# EAGLE design TX16S ISRM Adapter (EAGLE 9.6.2)
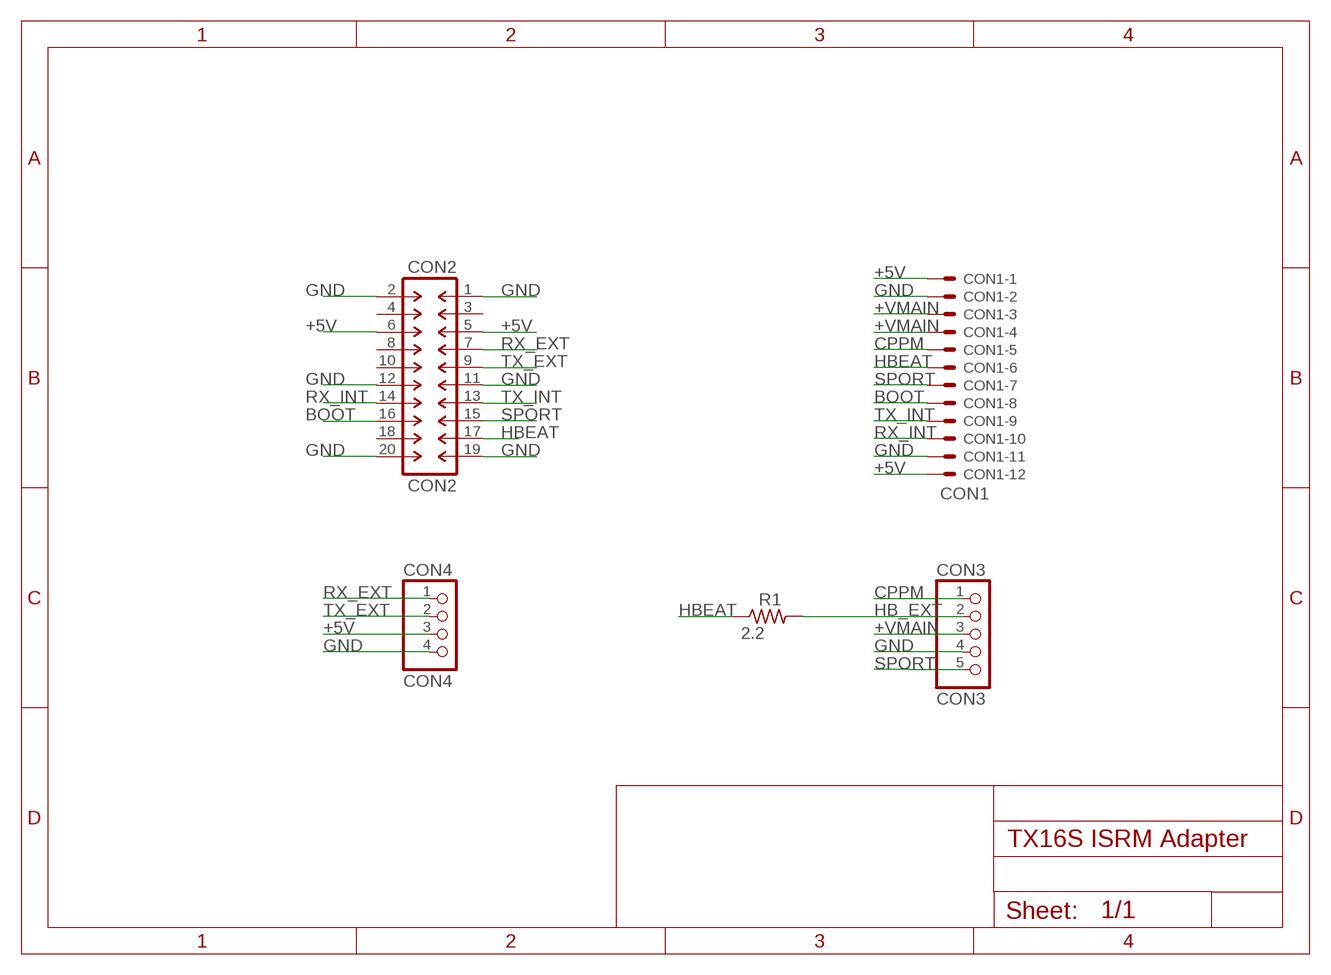
[diagram p0: schematic, sheet 1]

## Parts
CON1  CON1  53048-12  [53048-12]
CON2  CON2  M-2X10-DIL-2MM_M  [DIL-2MM-2X10_M]
CON3  CON3  PINHD-1X5  [1X05]
CON4  CON4  PINHD-1X4  [1X04]
R1  2.2  R-US_R0603  [R0603]

## Nets
+5V: CON1.1 CON1.12 CON2.5 CON2.6 CON4.3
+VMAIN: CON1.3 CON1.4 CON3.3
BOOT: CON1.8 CON2.16
CPPM: CON1.5 CON3.1
GND: CON1.2 CON1.11 CON2.1 CON2.2 CON2.11 CON2.12 CON2.19 CON2.20 CON3.4 CON4.4(GND)
HB_EXT: CON3.2 R1.2
HBEAT: CON1.6 CON2.17 R1.1
RX_EXT: CON2.7 CON4.1
RX_INT: CON1.10 CON2.14
SPORT: CON1.7 CON2.15 CON3.5
TX_EXT: CON2.9 CON4.2
TX_INT: CON1.9 CON2.13
Unconnected: CON2.3 CON2.4 CON2.8 CON2.10 CON2.18

## Library data of the parts
CON1 = con-molex-DK:53?-12: CONNECTOR wire to board 1.25 mm (.049 inch) pitch header
CON2 = con-headers-jp-DK:M-2X10-: MALE HEADER
CON3 = pinhead:PINHD-1X5: PIN HEADER
CON4 = pinhead:PINHD-1X4: PIN HEADER
R1 = rcl:R-US_: RESISTOR, American symbol; SPICEPREFIX: R

## Board
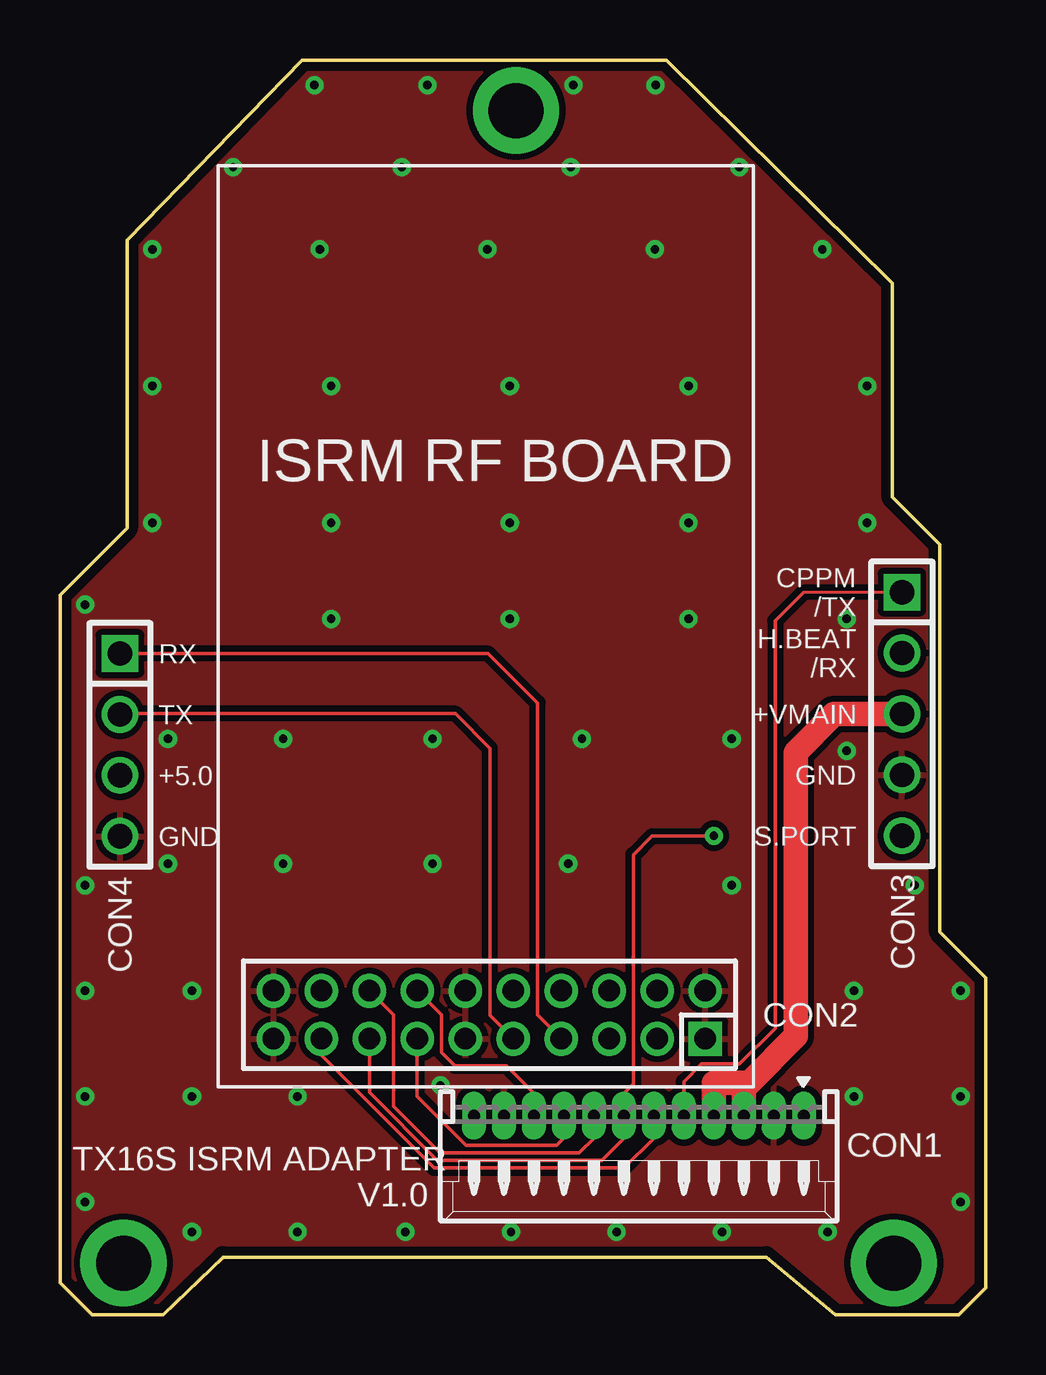
[diagram p1: board, top side]
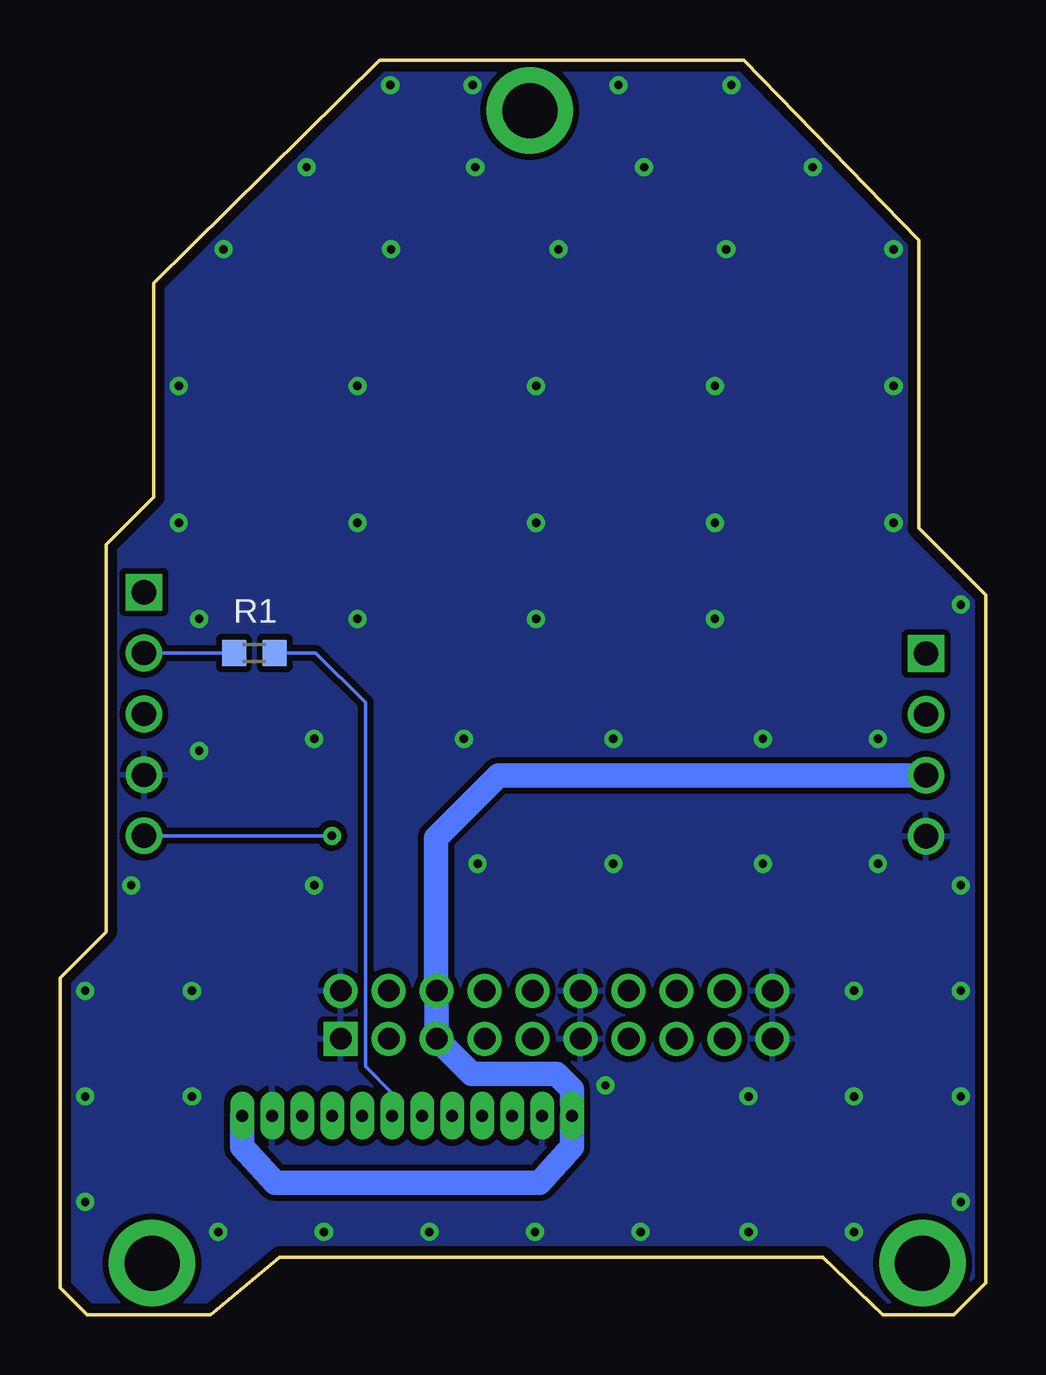
[diagram p2: board, bottom side, seen from below]

Size 38.6 x 52.3 mm. Coordinates in mm from the lower left corner, seen from the top.
Outline: 25.28,52.3 10.1,52.3 2.8,44.8 2.8,32.8 0,30 0,1.34 1.34,0 4.3,0 6.8,2.4 29.44,2.4 32.32,0 37.47,0 38.6,1.13 38.6,14.04 36.68,15.96 36.68,32.1 34.7,34.08 34.7,43 25.28,52.3
Copper layers (1*16): Top 0.035mm / dielectric 1.5mm / Bottom 0.035mm
Design rules "default *": minimum track width 6mil, minimum drill 0.35mm, track to track 6mil, track to pad 6mil, pad to pad 6mil, via to via 6mil, smd to smd 6mil, copper to edge 15mil, drill to drill 6mil, minimum pad ring 10mil, minimum via ring 8mil, stop-mask expansion 4mil, vias tented up to drill 20mil, thermal gap 10mil

### Footprints (pad centres in the part's own frame; a part is rotated, then mirrored left to right if it is on the bottom)
53048-12 = drill 0.5 pad 0.698 long: 1 -6.875,-1.25; 2 -5.625,-1.25; 3 -4.375,-1.25; 4 -3.125,-1.25; 5 -1.875,-1.25; 6 -0.625,-1.25; 7 0.625,-1.25; 8 1.875,-1.25; 9 3.125,-1.25; 10 4.375,-1.25; 11 5.625,-1.25; 12 6.875,-1.25
DIL-2MM-2X10_M = drill 0.9 square: 1 -9,1 | drill 0.9: 2 -9,-1; 3 -7,1; 4 -7,-1; 5 -5,1; 6 -5,-1; 7 -3,1; 8 -3,-1; 9 -1,1; 10 -1,-1; 11 1,1; 12 1,-1; 13 3,1; 14 3,-1; 15 5,1; 16 5,-1; 17 7,1; 18 7,-1; 19 9,1; 20 9,-1
1X05 = drill 1.016 square: 1 -5.08,0 | drill 1.016: 2 -2.54,0; 3 0,0; 4 2.54,0; 5 5.08,0
1X04 = drill 1.016 square: 1 -3.81,0 | drill 1.016: 2 -1.27,0; 3 1.27,0; 4 3.81,0
2,3-PAD = drill 2.3 pad 3.6: B2,3 0,0
R0603 = smd 1 x 1.1: 1 -0.85,0; 2 0.85,0

### Placement (x,y rotation side)
CON1  24.12,7.05 180 top
CON2  17.9,12.5 180 top
CON3  35.1,25.04 270 top
CON4  2.5,23.75 270 top
E$1  [2,3-PAD]  2.65,2.15 0 top
E$2  [2,3-PAD]  34.76,2.15 0 top
E$3  [2,3-PAD]  19.01,50.19 0 top
R1  30.5,27.58 180 bottom

### Tracks (layer width: path | path; a pad name or v marks a point on that pad's centre or on a via)
+5V
  Bottom 0.152: 22.92,13.52 CON2.6
  Bottom 0.813: 17.25,8.8 CON1.12
  Bottom 1.016: CON1.1 31,7 29.64,5.5 18.61,5.5 17.25,7 CON1.12 | 17.25,8.8 17.25,9.4 17.89,10.05 21.45,10.05 CON2.5 CON2.6 | CON4.3 20.31,22.48 22.92,19.87 22.92,13.52
+VMAIN
  Top 1.016: CON3.3 32.26,25.04 30.68,23.44 30.68,11.61 28.74,9.67 | 28.74,9.67 28.5,9.43 CON1.3 | 28.74,9.67 27.25,9.67 CON1.4
BOOT
  Top 0.152: CON1.8 22.25,7.36 21.64,6.75 15.85,6.75 13.91,8.69 13.91,12.49 CON2.16
CPPM
  Top 0.152: CON3.1 30.99,30.1 29.82,28.93 29.82,11.94 28.33,10.45 26.74,10.45 26,9.71 CON1.5
GND  (via drill 0.35)
  other vias: 15.86,9.56 5.5,3.45 9.9,3.45 14.4,3.45 18.8,3.45 23.2,3.45 27.6,3.45 32,3.45 1.05,17.9 1.05,13.5 1.05,9.1 1.05,4.7 35.63,17.9 37.55,13.5 37.55,9.1 37.55,4.7 1.05,29.6 3.85,33.01 3.85,38.71 3.85,44.41 10.61,51.25 15.32,51.25 21.4,51.25 24.83,51.25 7.22,47.83 28.32,47.83 31.78,44.41 33.65,33.01 33.65,38.71 14.25,47.83 21.29,47.83 10.83,44.41 17.82,44.41 24.8,44.41 11.3,38.71 18.75,38.71 26.2,38.71 11.3,33.01 18.75,33.01 26.2,33.01 11.3,29 18.75,29 26.2,29 32.8,29 32.8,23.5 4.5,24 9.3,24 15.53,24 21.76,24 28,24 4.5,18.8 9.3,18.8 15.53,18.8 21.19,18.8 28,17.9 5.5,13.5 5.5,9.1 9.9,9.1 33.1,9.1 33.1,13.5
  pour Top (isolate 0.254): 1.34,0 4.3,0 6.8,2.4 29.44,2.4 32.32,0 37.47,0 38.6,1.13 38.6,14.04 36.68,15.96 36.68,32.1 34.7,34.08 34.7,43 25.28,52.3 10.1,52.3 2.8,44.8 2.8,32.8 0,30 0,1.34
  pour Bottom (isolate 0.254): 1.34,0 4.3,0 6.8,2.4 29.44,2.4 32.32,0 37.47,0 38.6,1.13 38.6,14.04 36.68,15.96 36.68,32.1 34.7,34.08 34.7,43 25.28,52.3 10.1,52.3 2.8,44.8 2.8,32.8 0,30 0,1.34
HB_EXT
  Bottom 0.152: CON3.2 R1.2
HBEAT
  Top 0.152: CON2.17 10.9,10.82 15.6,6.12 23.52,6.12 24.76,7.36 CON1.6
  Bottom 0.152: CON1.6 24.75,9.23 25.86,10.35 25.86,25.52 27.94,27.58 R1.1
RX_EXT
  Top 0.152: CON2.7 19.91,12.49 19.91,25.5 17.85,27.56 CON4.1
RX_INT
  Top 0.152: CON2.14 15.91,12.49 15.91,10.93 16.47,10.37 18.61,10.37 19.75,9.23 CON1.10
SPORT  (via drill 0.35)
  Top 0.152: CON2.15 12.9,9.26 15.72,6.44 22.59,6.44 23.5,7.36 CON1.7 23.5,9.23 23.9,9.63 23.9,19.17 24.68,19.95 v27.26,19.96
  Bottom 0.152: v27.26,19.96 CON3.5
TX_EXT
  Top 0.152: CON2.9 17.92,12.48 17.92,23.61 16.48,25.05 2.53,25.05 CON4.2
TX_INT
  Top 0.152: CON1.9 21,7.37 20.69,7.06 16.92,7.06 14.88,9.1 14.88,11.48 CON2.13

### Text on the board
tNames: ISRM RF BOARD | CPPM / /TX | RX | H.BEAT / /RX | TX | +VMAIN | +5.0 | GND | GND | S.PORT | CON2 | TX16S ISRM ADAPTER | V1.0